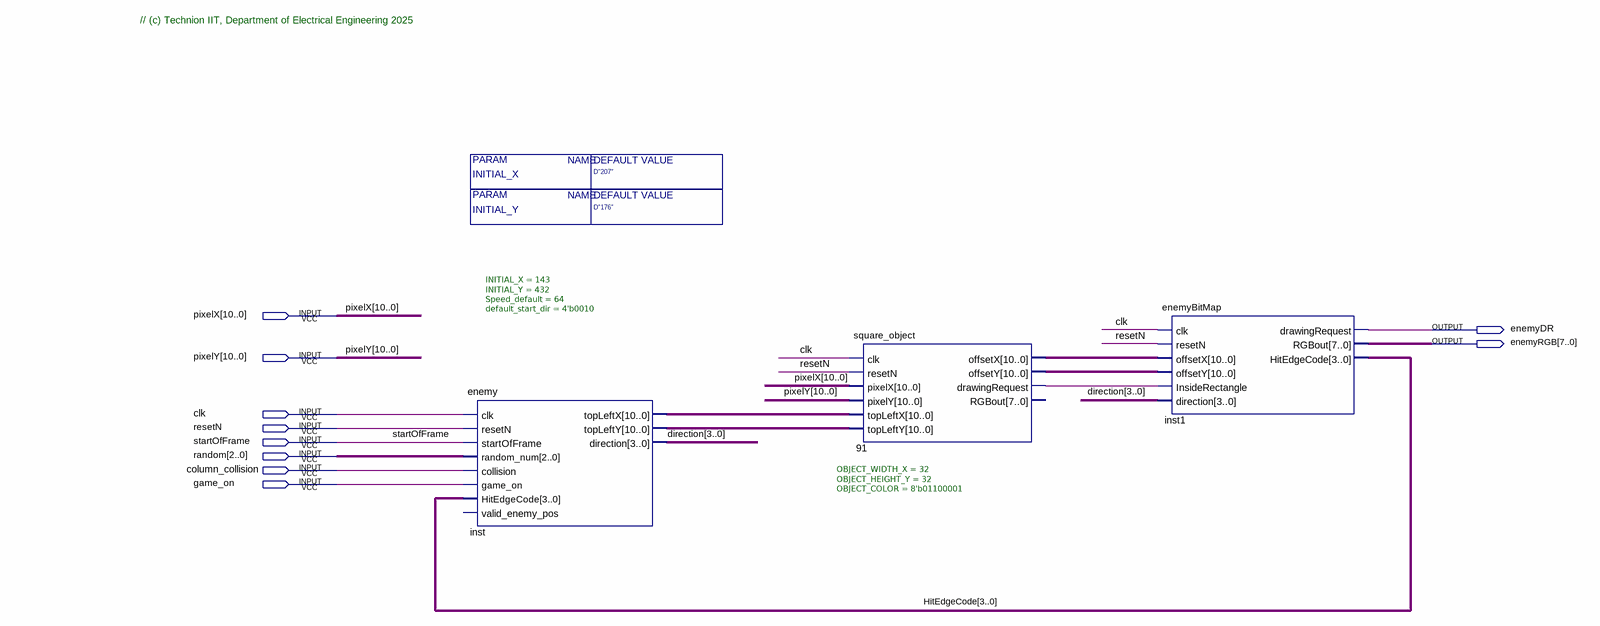
[diagram p0: schematic sheet]
// Quartus schematic Enemy2_Block_T.bdf as structural Verilog: 3 symbols, 10 pins
module Enemy2_Block_T #(parameter INITIAL_X = "D\"207\"", parameter INITIAL_Y = "D\"176\"") (
  input  [10:0] pixelX,
  input  [10:0] pixelY,
  input  clk,
  input  resetN,
  input  startOfFrame,
  input  [2:0] random,
  input  column_collision,
  input  game_on,
  output enemyDR,
  output [7:0] enemyRGB
);

  wire n91_drawingrequest;
  wire [3:0] direction, HitEdgeCode;
  wire [10:0] inst_topleftx, inst_toplefty, n91_offsetx, n91_offsety;

  enemy #(.INITIAL_X(143), .INITIAL_Y(432), .Speed_default(64), .default_start_dir(4'b0010)) inst (
    .clk(clk), .resetN(resetN), .startOfFrame(startOfFrame), .random_num(random),
    .collision(column_collision), .game_on(game_on), .HitEdgeCode(HitEdgeCode), .topLeftX(inst_topleftx),
    .topLeftY(inst_toplefty), .direction(direction));  // open: valid_enemy_pos
  square_object #(.OBJECT_WIDTH_X(32), .OBJECT_HEIGHT_Y(32), .OBJECT_COLOR(8'b01100001)) u_91 (
    .clk(clk), .resetN(resetN), .pixelX(pixelX), .pixelY(pixelY), .topLeftX(inst_topleftx),
    .topLeftY(inst_toplefty), .offsetX(n91_offsetx), .offsetY(n91_offsety),
    .drawingRequest(n91_drawingrequest));  // open: RGBout
  enemyBitMap inst1 (
    .clk(clk), .resetN(resetN), .offsetX(n91_offsetx), .offsetY(n91_offsety),
    .InsideRectangle(n91_drawingrequest), .direction(direction), .drawingRequest(enemyDR), .RGBout(enemyRGB),
    .HitEdgeCode(HitEdgeCode));

  // Notes on the sheet:
  //   // (c) Technion IIT, Department of Electrical Engineering 2025
endmodule
